# Altium schematic sheet uc2.SchDoc: Microcontroller 2
size A4; Author: Marcel Hellwig; Organization: Hamburg Bit-Bots; Address1: Vogt-Kölln-Str. 30; Address2: 22527 Hamburg; Address3: Germany; Address4: www.bit-bots.de; DocumentNumber: 6; Revision: A; SheetNumber: 6; SheetTotal: 16; EMail: info@bit-bots.de
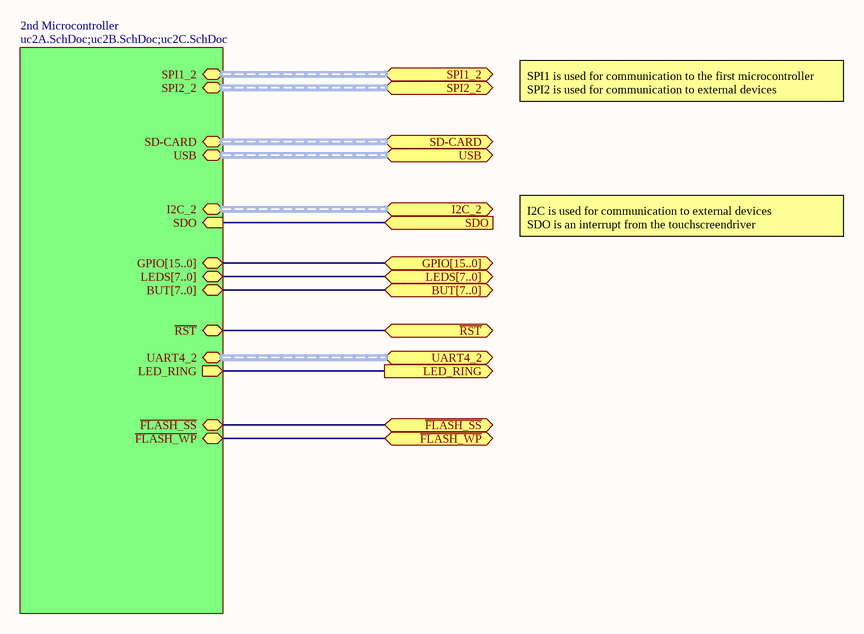
[diagram p0: uc2.SchDoc]

## Sub-sheets
2nd Microcontroller = uc2A.SchDoc;uc2B.SchDoc;uc2C.SchDoc: SPI1_2 (harness SPI), SD-CARD (harness SD-Card), USB (harness USB), I2C_2 (harness I²C), ~{RST}, SDO (in), GPIO[15..0] (bidir), LEDS[7..0] (bidir), BUT[7..0] (bidir), SPI2_2 (harness SPI), UART4_2 (harness UART), LED_RING (out), ~{FLASH_SS} (bidir), ~{FLASH_WP} (bidir)

## Ports
BUT[7..0] (bidir), GPIO[15..0] (bidir), I2C_2 (harness I²C), LED_RING (out), LEDS[7..0] (bidir), SD-CARD (harness SD-Card), SDO (in), SPI1_2 (harness SPI), SPI2_2 (harness SPI), UART4_2 (harness UART), USB (harness USB), ~{FLASH_SS} (bidir), ~{FLASH_WP} (bidir), ~{RST}

## Nets
~{FLASH_SS}: port ~{FLASH_SS}, sheet 2nd Microcontroller/~{FLASH_SS}
~{FLASH_WP}: port ~{FLASH_WP}, sheet 2nd Microcontroller/~{FLASH_WP}
~{RST}: port ~{RST}, sheet 2nd Microcontroller/~{RST}
LED_RING: port LED_RING, sheet 2nd Microcontroller/LED_RING
SDO: port SDO, sheet 2nd Microcontroller/SDO

## Buses and harness runs
bus port BUT[7..0] = sheet 2nd Microcontroller/BUT[7..0]
bus port GPIO[15..0] = sheet 2nd Microcontroller/GPIO[15..0]
bus port LEDS[7..0] = sheet 2nd Microcontroller/LEDS[7..0]
harness port I2C_2 = sheet 2nd Microcontroller/I2C_2
harness port SD-CARD = sheet 2nd Microcontroller/SD-CARD
harness port SPI1_2 = sheet 2nd Microcontroller/SPI1_2
harness port SPI2_2 = sheet 2nd Microcontroller/SPI2_2
harness port UART4_2 = sheet 2nd Microcontroller/UART4_2
harness port USB = sheet 2nd Microcontroller/USB

## Notes on the sheet
- SPI1 is used for communication to the first microcontroller
  SPI2 is used for communication to external devices
- I2C is used for communication to external devices
  SDO is an interrupt from the touchscreendriver
- Project:
- Author:
- Title:
- Rev:
- Date:
- Time:
- Sheet
- of